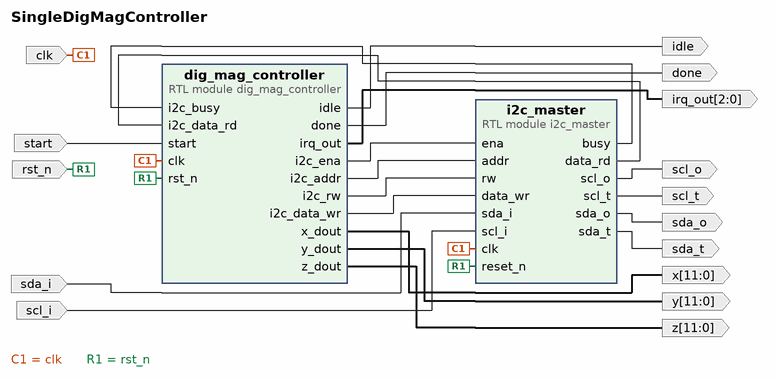
[diagram p0: block diagram of the top level]
# Vivado block design SingleDigMagController, xczu3eg-sbva484-1-i, Vivado 2020.2
create_bd_design SingleDigMagController

create_bd_port -dir I -type clk clk
create_bd_port -dir O idle
create_bd_port -dir I -type rst rst_n
create_bd_port -dir I scl_i
create_bd_port -dir O scl_o
create_bd_port -dir O scl_t
create_bd_port -dir I sda_i
create_bd_port -dir O sda_o
create_bd_port -dir O sda_t
create_bd_port -dir I start
create_bd_port -dir O -from 11 -to 0 x
create_bd_port -dir O -from 11 -to 0 y
create_bd_port -dir O -from 11 -to 0 z
create_bd_port -dir O -from 2 -to 0 irq_out
create_bd_port -dir O done

create_bd_cell -type module -reference i2c_master i2c_master
set_property -dict {CONFIG.bus_clk 100000} [get_bd_cells i2c_master]
create_bd_cell -type module -reference dig_mag_controller dig_mag_controller

# ---- connections ----

connect_bd_net -net dig_mag_controller_0_i2c_ena [get_bd_pins dig_mag_controller/i2c_ena] [get_bd_pins i2c_master/ena]
connect_bd_net -net dig_mag_controller_0_i2c_addr [get_bd_pins dig_mag_controller/i2c_addr] [get_bd_pins i2c_master/addr]
connect_bd_net -net dig_mag_controller_0_i2c_rw [get_bd_pins dig_mag_controller/i2c_rw] [get_bd_pins i2c_master/rw]
connect_bd_net -net dig_mag_controller_0_i2c_data_wr [get_bd_pins dig_mag_controller/i2c_data_wr] [get_bd_pins i2c_master/data_wr]
connect_bd_net -net i2c_master_0_busy [get_bd_pins i2c_master/busy] [get_bd_pins dig_mag_controller/i2c_busy]
connect_bd_net -net i2c_master_0_data_rd [get_bd_pins i2c_master/data_rd] [get_bd_pins dig_mag_controller/i2c_data_rd]
connect_bd_net [get_bd_ports clk] [get_bd_pins i2c_master/clk] [get_bd_pins dig_mag_controller/clk]
connect_bd_net [get_bd_pins dig_mag_controller/idle] [get_bd_ports idle]
connect_bd_net [get_bd_pins dig_mag_controller/z_dout] [get_bd_ports z]
connect_bd_net [get_bd_pins dig_mag_controller/y_dout] [get_bd_ports y]
connect_bd_net [get_bd_pins dig_mag_controller/x_dout] [get_bd_ports x]
connect_bd_net [get_bd_ports start] [get_bd_pins dig_mag_controller/start]
connect_bd_net [get_bd_pins i2c_master/sda_t] [get_bd_ports sda_t]
connect_bd_net [get_bd_pins i2c_master/sda_o] [get_bd_ports sda_o]
connect_bd_net [get_bd_ports sda_i] [get_bd_pins i2c_master/sda_i]
connect_bd_net [get_bd_pins i2c_master/scl_t] [get_bd_ports scl_t]
connect_bd_net [get_bd_pins i2c_master/scl_o] [get_bd_ports scl_o]
connect_bd_net [get_bd_ports scl_i] [get_bd_pins i2c_master/scl_i]
connect_bd_net [get_bd_ports rst_n] [get_bd_pins i2c_master/reset_n] [get_bd_pins dig_mag_controller/rst_n]
connect_bd_net [get_bd_pins dig_mag_controller/irq_out] [get_bd_ports irq_out]
connect_bd_net [get_bd_pins dig_mag_controller/done] [get_bd_ports done]

validate_bd_design
save_bd_design
